# EasyEDA schematic Schema_plan_b syntheseproject_V1.json
TITLE: Sheet_1; REV: 1.0; Date: 2022-10-14; Sheet: 1/1; Company: Your Company
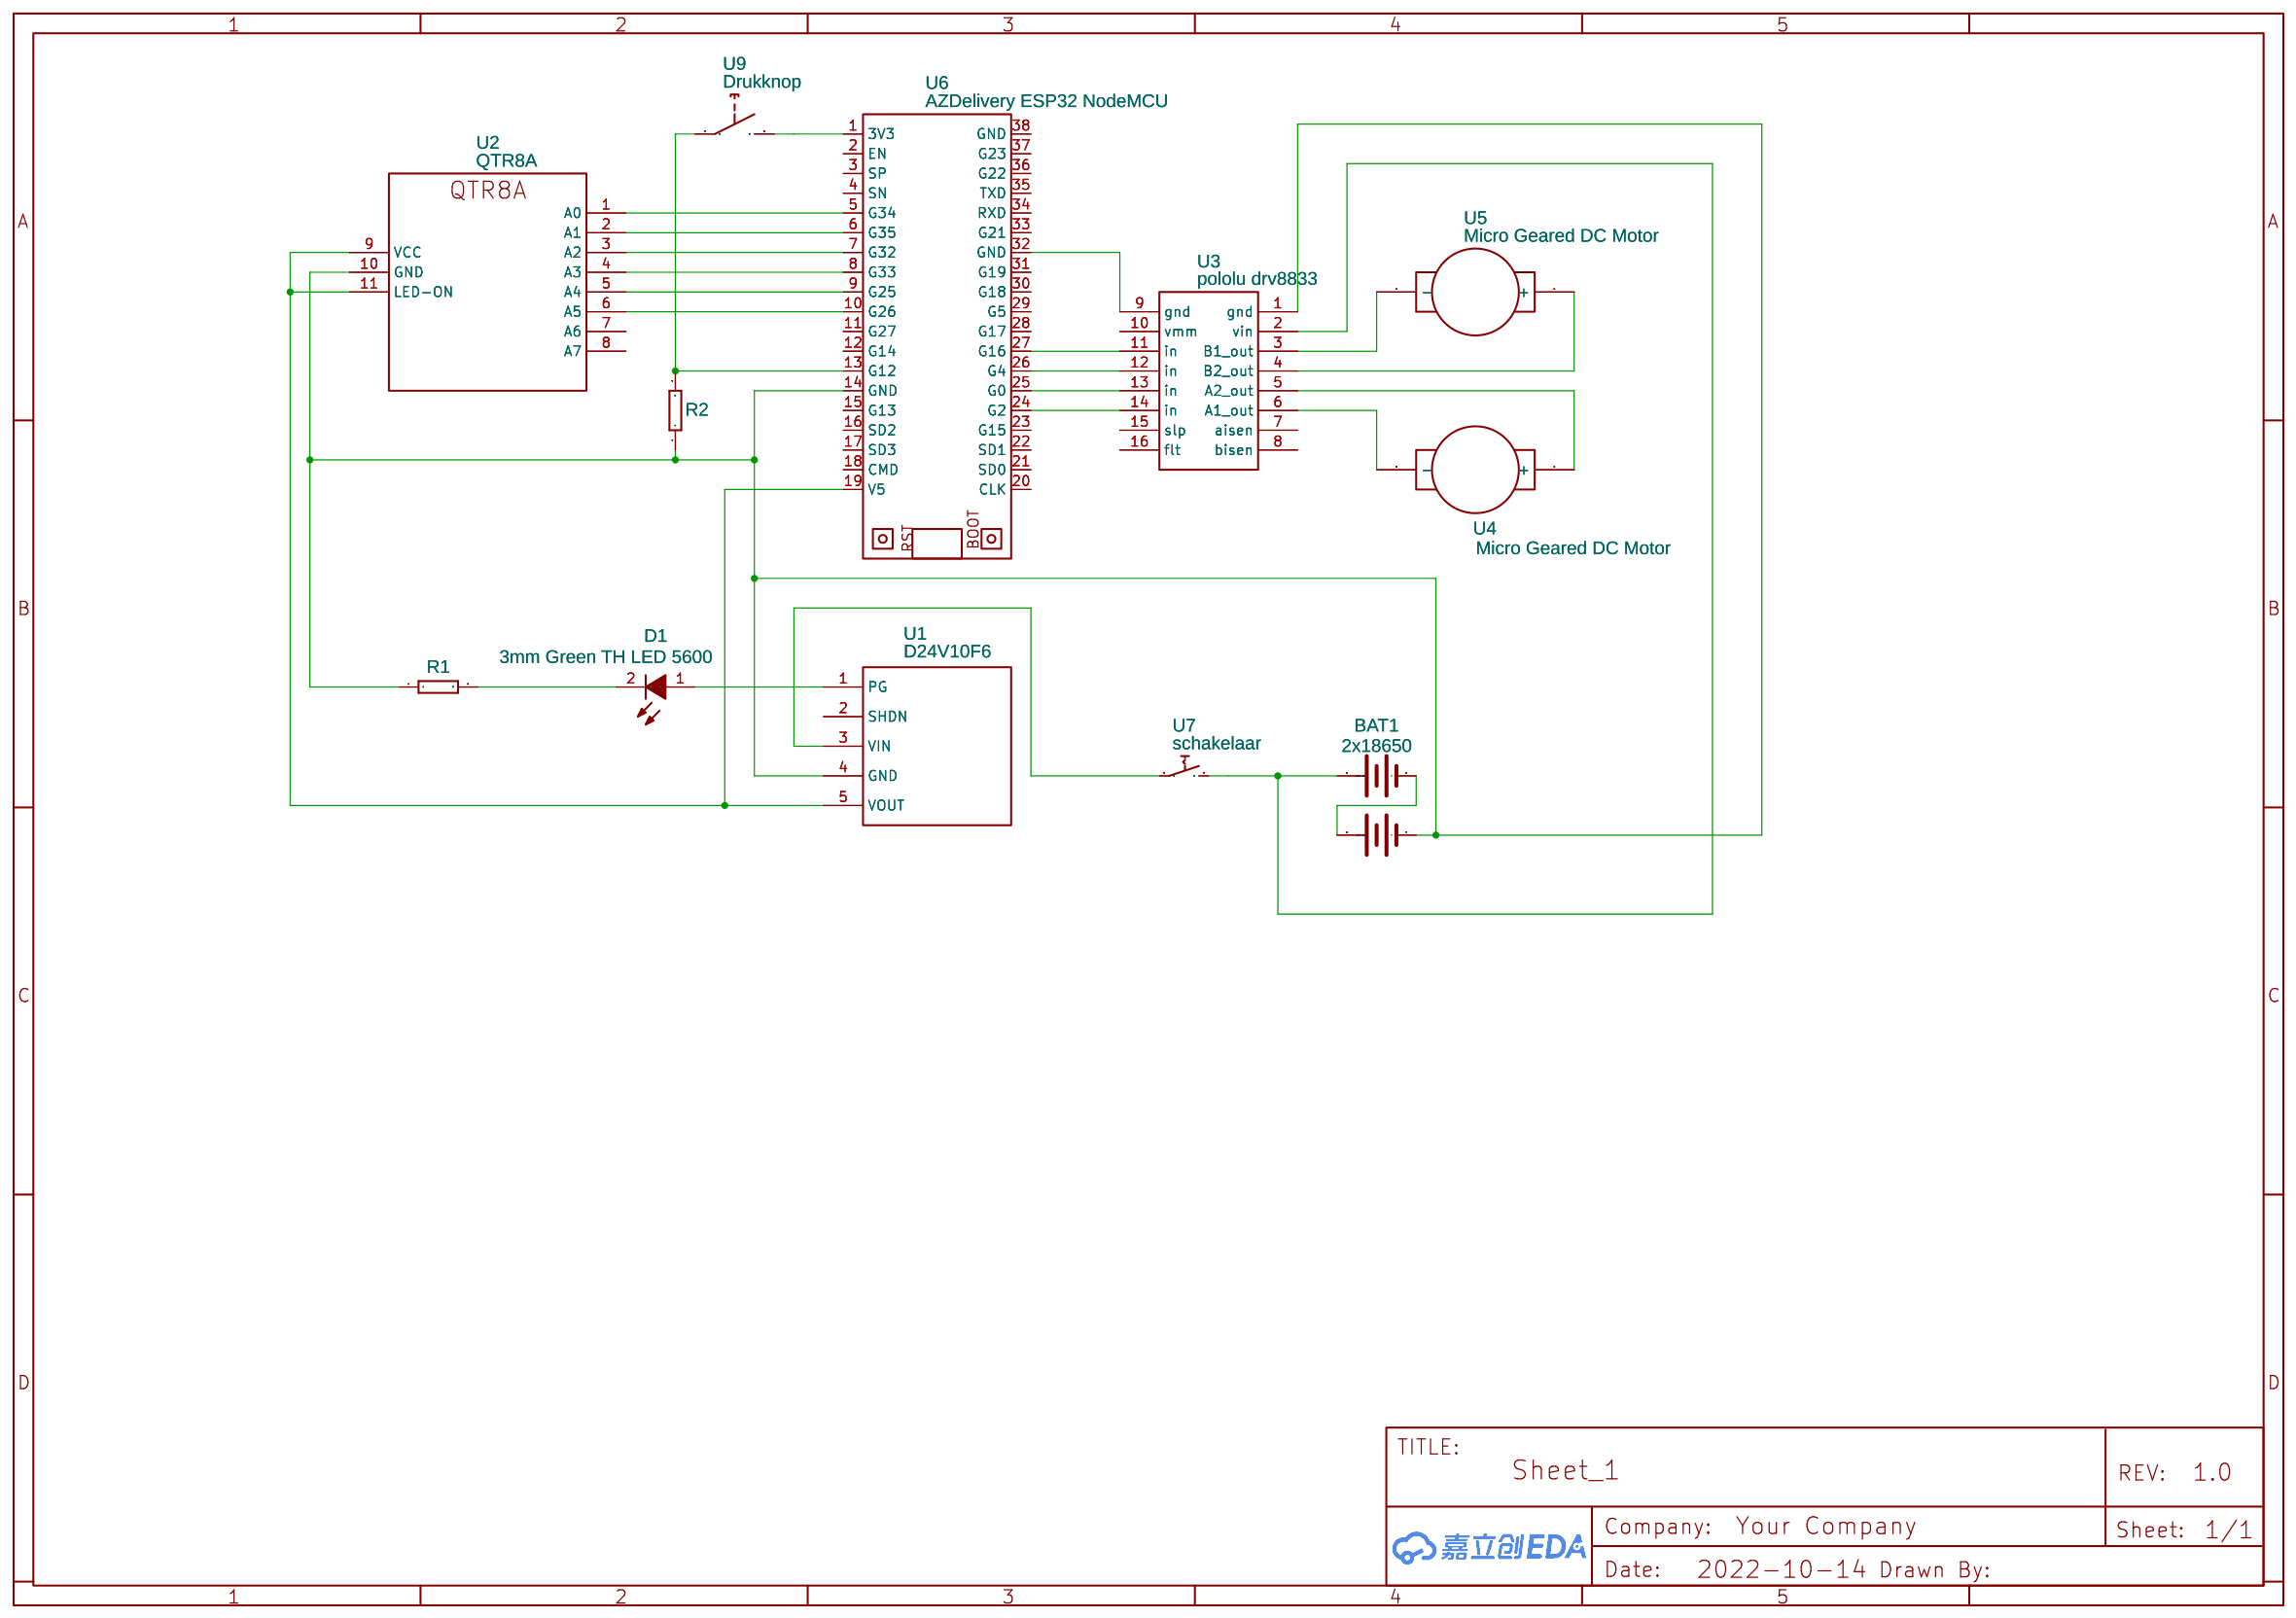
[diagram p0: schematic sheet]

## Parts
BAT1  2x18650  [BAT-TH_18650-2]
D1  3mm Green TH LED 5600  [LED-TH_LED-DP2-2LED]
R1  RESISTOR-0402  [R402]
R2  RESISTOR-0402  [R402]
U1  D24V10F6  [D24V10F6]
U2  QTR8A  [QTR8A]
U3  pololu drv8833  [POLOLU DRV8833]
U4  Micro Geared DC Motor  [MICRO GEARED DC MOTOR PADS]
U5  Micro Geared DC Motor  [MICRO GEARED DC MOTOR PADS]
U6  AZDelivery ESP32 NodeMCU  [AZDELIVERY ESP32 NODEMCU2]
U7  schakelaar
U9  Drukknop

## Library data of the parts
BAT1 = 18650并联电池盒: Supplier: LCSC; Supplier Part: C9900010344; Manufacturer: null; link: https://atta.szlcsc.comnull; JLCPCB Part Class: Extended Part; Contributor: LCSC
D1 = 3mm Green TH LED 5600: Supplier: Digi-Key; Manufacturer: VccLite; Manufacturer Part: 5600; Supplier Part: L20325-ND; link: https://vcclite.com/product/5602f5-5v/; Contributor: pks.tec
R1 R2 = RESISTOR-0402: Contributor: DangerousPrototype
U1 = D24V10F6: Manufacturer: Pololu; Manufacturer Part: 2832; Contributor: AQUAMOX
U2 = QTR8A: Manufacturer: POLOLU; Supplier: POLOLU; link: https://www.pololu.com/product/960/pictures; Contributor: yeison buitrago rojas
U3 = pololu drv8833: Contributor: foxalex556
U4 U5 = Micro Geared DC Motor: link: https://www.amazon.com/dp/B07N7PY71F?psc=1&ref=ppx_yo2ov_dt_b_product_details; Contributor: Guest
U6 = AZDelivery ESP32 NodeMCU: Manufacturer: AZDelivery; Supplier: AZDelivery; Supplier Part: ESP32-WROOM-32; Contributor: Raphaël Ponthieu
U7 = schakelaar: Contributor: onschacline
U9 = Drukknop: Contributor: Canjo West

## Nets
Net-(BAT1-1): BAT1.1(+) U3.2(vin) U7.1
Net-(BAT1-2): BAT1.2(+) BAT1.3(-)
Net-(BAT1-4): BAT1.4(-) R1.1 R2.1 U1.4(GND) U2.10(GND) U3.1(gnd) U6.14(GND)
Net-(D1-1): D1.1(A) U1.1(PG)
Net-(D1-2): D1.2(K) R1.2
Net-(R2-2): R2.2 U6.13(G12) U9.1
Net-(U1-3): U1.3(VIN) U7.2
Net-(U1-5): U1.5(VOUT) U2.9(VCC) U2.11(LED-ON) U6.19(V5)
Net-(U2-1): U2.1(A0) U6.5(G34)
Net-(U2-2): U2.2(A1) U6.6(G35)
Net-(U2-3): U2.3(A2) U6.7(G32)
Net-(U2-4): U2.4(A3) U6.8(G33)
Net-(U2-5): U2.5(A4) U6.9(G25)
Net-(U2-6): U2.6(A5) U6.10(G26)
Net-(U3-3): U3.3(B1 out) U5.1(-)
Net-(U3-4): U3.4(B2 out) U5.2(+)
Net-(U3-5): U3.5(A2 out) U4.2(+)
Net-(U3-6): U3.6(A1 out) U4.1(-)
Net-(U3-9): U3.9(gnd) U6.32(GND)
Net-(U3-11): U3.11(in) U6.27(G16)
Net-(U3-12): U3.12(in) U6.26(G4)
Net-(U3-13): U3.13(in) U6.25(G0)
Net-(U3-14): U3.14(in) U6.24(G2)
Net-(U6-1): U6.1(3V3) U9.2

Not connected (* = marked no-connect by the designer): U1 2(SHDN); U2 7(A6) 8(A7); U3 7(aisen) 8(bisen) 10(vmm) 15(slp) 16(flt); U6 2(EN) 3(SP) 4(SN) 11(G27) 12(G14) 15(G13) 16(SD2) 17(SD3) 18(CMD) 20(CLK) 21(SD0) 22(SD1) 23(G15) 28(G17) 29(G5) 30(G18) 31(G19) 33(G21) 34(RXD) 35(TXD) 36(G22) 37(G23) 38(GND)
